# Altium schematic sheet Sensors.SchDoc: Sensors
size A4; Author: Miłosz Werner; Organization: Wrocław University of Science and Technology; Revision: 1.0; SheetNumber: 3; SheetTotal: 5
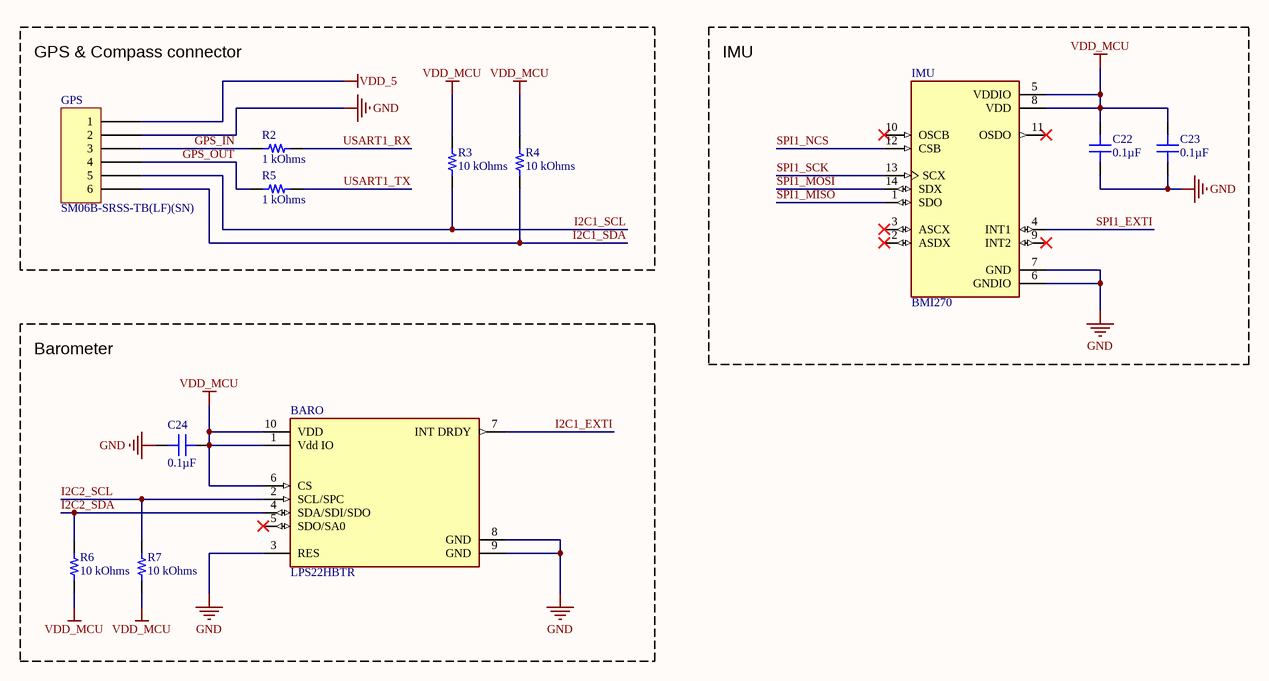
[diagram p0: Sensors.SchDoc]

## Parts
BARO  LPS22HBTR  [FP-HLGA-10L-8479831-0]
C22  0.1µF  [CAP 0603_1608]
C23  0.1µF  [CAP 0603_1608]
C24  0.1µF  [CAP 0603_1608]
GPS  SM06B-SRSS-TB(LF)(SN)  [JST SM06B-SRSS-TB]
IMU  BMI270  [XDCR_BMI270]
R2  1 kOhms  [RES 0603_1608]
R3  10 kOhms  [RES 0603_1608]
R4  10 kOhms  [RES 0603_1608]
R5  1 kOhms  [RES 0603_1608]
R6  10 kOhms  [RES 0603_1608]
R7  10 kOhms  [RES 0603_1608]

## Blocks framed on the sheet
GPS & Compass connector: GPS R2-R5
IMU: C22 C23 IMU
Barometer: BARO C24 R6 R7

## Nets
GND: BARO.3(RES) BARO.8(GND) BARO.9(GND) C22.2 C23.2 C24.2 GPS.2 IMU.6(GNDIO) IMU.7(GND)
VDD_5: GPS.1
VDD_MCU: BARO.1(Vdd_IO) BARO.6(CS) BARO.10(VDD) C22.1 C23.1 C24.1 IMU.5(VDDIO) IMU.8(VDD) R3.2 R4.2 R6.1 R7.1
GPS_IN: GPS.3 R2.1
GPS_OUT: GPS.4 R5.1
I2C1_EXTI: BARO.7(INT_DRDY)
I2C1_SCL: GPS.5 R3.1
I2C1_SDA: GPS.6 R4.1
I2C2_SCL: BARO.2(SCL/SPC) R7.2
I2C2_SDA: BARO.4(SDA/SDI/SDO) R6.2
SPI1_EXTI: IMU.4(INT1)
SPI1_MISO: IMU.1(SDO)
SPI1_MOSI: IMU.14(SDX)
SPI1_NCS: IMU.12(CSB)
SPI1_SCK: IMU.13(SCX)
USART1_RX: R2.2
USART1_TX: R5.2

Not connected (* = marked no-connect by the designer): BARO 5(SDO/SA0)*; IMU 2(ASDX)* 3(ASCX)* 9(INT2)* 10(OSCB)* 11(OSDO)*

## Notes on the sheet
- Title:
- Date:
- File:
- Project:
- Organization:
- Size:
- A4
- Author:
- Sheet
- Of
- Revision:

## Library data of the parts
BARO = CMP-12182-000004-1: MEMS NANO PRESSURE SENSOR: 260-1; Manufacturer: STMicroelectronics; Sensor Output: I2C,SPI; Port Style: No Port; Max Supply Voltage: 3.6V; Operating Supply Current: 3-12uA; Min Supply Voltage: 1.7V; Device Class L3: unset; Device Class L1: Sensors; Manufacturer Part Number: LPS22HBTR; Temperature Range High: +85°C; Digikey Description: MEMS NANO PRESSURE SENSOR: 260-1; Device Class L2: Pressure Sensors; RoHS: TRUE; Lead Free: Yes; Height: 0.8mm; Automotive: No; Octopart: https://octopart.com/lps22hbtr-stmicroelectronics-51851131; Package: HLGA-10L-8479831; Temperature Range Low: -40°C; Category: IC; Temperature: -40°C to +85°C; ComponentLink2Description: Datasheet; ComponentLink2URL: https://www.st.com/resource/en/datasheet/lps22hb.pdf; Footprint Url: https://www.st.com/content/ccc/resource/technical/document/technical_note/73/17/9c/16/dd/96/4a/01/CD00134799.pdf/files/CD00134799.pdf/jcr:content/translations/en.CD00134799.pdf
C22-C24 = 06033C104JAT4A: CAP CER 0.1UF 25V X7R 0603; manufacturer: AVX Corporation; Tolerance: ±5%; Part Number: 06033C104JAT4A; Value: 0.1µF; Applications: General Purpose; Capacitance: 0.1µF; componentlink1description: Datasheet; componentlink1url: http://datasheets.avx.com/X7RDielectric.pdf; componentlink2description: DigiKey Link; componentlink2url: http://digikey.com/product-detail/en/avx-corporation/06033C104JAT4A/478-11510-1-ND/8107711; Device Package: 0603 (1608 Metric); lastupdated: 02.09.2020 01:03:22; Lifecycle Status: Active; Minimum Order: 1; Mounting Type: Surface Mount, MLCC; Operating Temperature: -55°C ~ 125°C; Package / Case: 0603 (1608 Metric); packaging: TapeAndReel; partid: 10083; Part Status: Active; price: 0.06; series: -; Size / Dimension: 0.063" L x 0.032" W (1.60mm x 0.81mm); Supplier 1: DigiKey; Supplier Part Number 1: 478-11510-1-ND; Temperature Coefficient: X7R; Thickness (Max): 0.035" (0.90mm); Voltage - Rated: 25V
GPS = SM06B-SRSS-TB(LF)(SN): CONN HEADER SMD R/A 6POS 1MM; Manufacturer: JST Sales America Inc.; Current Rating (Amps): 0.7A; Material Flammability Rating: UL94 V-0; Number of Positions: 6; Number of Positions Loaded: All; Pitch - Mating: 0.039" (1.00mm); Shrouding: Shrouded - 4 Wall; Style: Board to Cable/Wire; Voltage Rating: 50V; Part Number: SM06B-SRSS-TB(LF)(SN); ComponentLink1Description: Datasheet; ComponentLink1URL: http://www.jst-mfg.com/product/pdf/eng/eSH.pdf; ComponentLink2Description: DigiKey Link; ComponentLink2URL: http://digikey.com/product-detail/en/jst-sales-america-inc/SM06B-SRSS-TB-LF-SN/455-1806-1-ND/926877; Connector Type: Header; Contact Finish - Mating: Tin; Contact Finish - Post: Tin; Contact Material: Copper Alloy; Contact Shape: Square; Contact Type: Male Pin; Fastening Type: Push-Pull; Features: Solder Retention; Insulation Color: Natural; Insulation Height: 0.114" (2.90mm); Insulation Material: Polyamide (PA), Nylon; LastUpdated: 12.01.2020 23:42:14; Lifecycle Status: Active; Minimum Order: 1; Mounting Type: Surface Mount, Right Angle; Number of Rows: 1; Operating Temperature: -25°C ~ 85°C; Packaging: TapeAndReel; PartId: 64; Part Status: Active; Price: 0.36; Series: SR; Supplier 1: DigiKey; Supplier Part Number 1: 455-1806-1-ND; Termination: Solder
IMU = BMI270: IMU ACCEL/GYRO I2C/SPI 14LGA; MF: {'manufacturer': u'Bosch Sensortec'}; Availability: Unavailable; MP: BMI270; Price: None; Package: None; Value: *
R2 R5 = SG73S1JTTD1001F: RES 1K OHM 1% 1/5W 0603; Manufacturer: KOA Speer Electronics, Inc.; Power (Watts): 0.2W, 1/5W; Temperature Coefficient: ±100ppm/°C; Part Number: SG73S1JTTD1001F; Value: 1 kOhms; ComponentLink1Description: Datasheet; ComponentLink1URL: http://www.koaspeer.com/catimages/Products/SG73S/SG73S.pdf; ComponentLink2Description: DigiKey Link; ComponentLink2URL: https://www.digikey.com/en/products/detail/koa-speer-electronics-inc/SG73S1JTTD1001F/10279992; Composition: Thick Film; Device Package: 0603 (1608 Metric); Features: Automotive AEC-Q200, Moisture Resistant, Pulse Withstanding; Height - Seated (Max): 0.022" (0.55mm); LastUpdated: 19.09.2022 13:20:55; Lifecycle Status: Active; Minimum Order: 1; Number of Terminations: 2; Operating Temperature: -55°C ~ 155°C; Package / Case: 0603 (1608 Metric); Packaging: TapeAndReel; PartId: 26528; Part Status: Active; Price: 0.01; Ratings: AEC-Q200; Resistance: 1 kOhms; Series: SG73S; Size / Dimension: 0.063" L x 0.031" W (1.60mm x 0.80mm); Supplier 1: DigiKey; Supplier Part Number 1: 2019-SG73S1JTTD1001FCT-ND; Supplier Device Package: 0603; Tolerance: ±1%
R3 R4 R6 R7 = RS73F1JTTD1002B: RES 10K OHM 0.1% 1/5W 0603; Manufacturer: KOA Speer Electronics, Inc.; Power (Watts): 0.2W, 1/5W; Temperature Coefficient: ±25ppm/°C; Part Number: RS73F1JTTD1002B; Value: 10 kOhms; ComponentLink1Description: Datasheet; ComponentLink1URL: http://www.koaspeer.com/pdfs/RS73.pdf; ComponentLink2Description: DigiKey Link; ComponentLink2URL: https://www.digikey.com/en/products/detail/koa-speer-electronics-inc/RS73F1JTTD1002B/11594389; Composition: Thick Film; Device Package: 0603 (1608 Metric); Features: Automotive AEC-Q200, Moisture Resistant; Height - Seated (Max): 0.022" (0.55mm); LastUpdated: 15.07.2022 11:48:43; Lifecycle Status: Active; Minimum Order: 1; Number of Terminations: 2; Operating Temperature: -55°C ~ 155°C; Package / Case: 0603 (1608 Metric); Packaging: TapeAndReel; PartId: 56378; Part Status: Active; Price: 0.08; Ratings: AEC-Q200; Resistance: 10 kOhms; Series: RS73; Size / Dimension: 0.063" L x 0.031" W (1.60mm x 0.80mm); Supplier 1: DigiKey; Supplier Part Number 1: 2019-RS73F1JTTD1002BCT-ND; Supplier Device Package: 0603; Tolerance: ±0.1%